# EAGLE design Clamp board - 2S-3.7V rev C- 4 layer v2 (EAGLE 9.3.1)
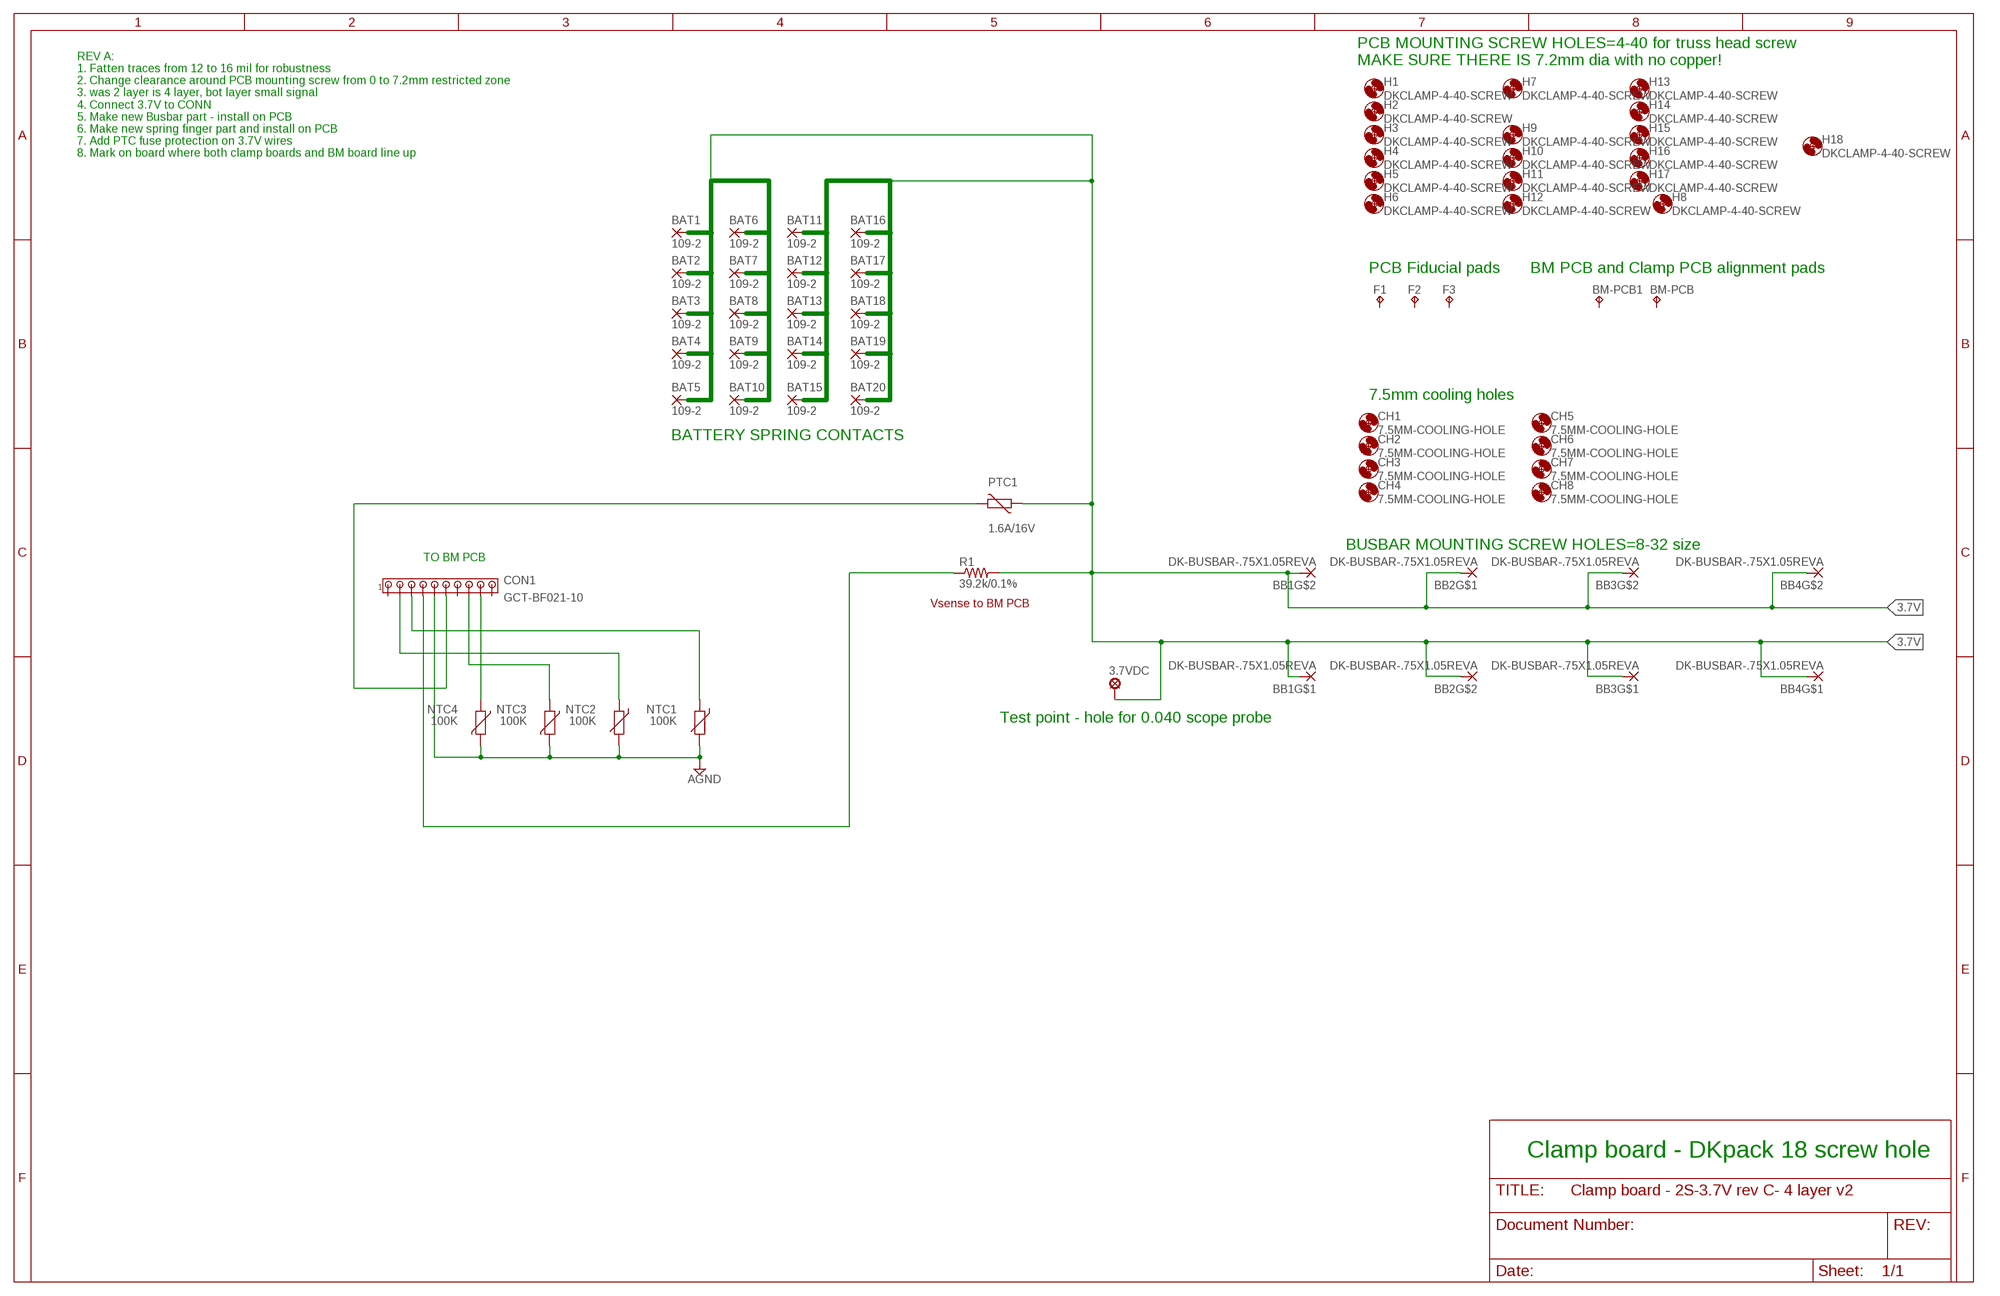
[diagram p0: schematic, sheet 1]

## Parts
3.7VDC  LSP10  [LSP10]
BAT1  109-2  DK-SPRING-REV2  [DK-SPRING-FINGER-REV2]
BAT2  109-2  DK-SPRING-REV2  [DK-SPRING-FINGER-REV2]
BAT3  109-2  DK-SPRING-REV2  [DK-SPRING-FINGER-REV2]
BAT4  109-2  DK-SPRING-REV2  [DK-SPRING-FINGER-REV2]
BAT5  109-2  DK-SPRING-REV2  [DK-SPRING-FINGER-REV2]
BAT6  109-2  DK-SPRING-REV2  [DK-SPRING-FINGER-REV2]
BAT7  109-2  DK-SPRING-REV2  [DK-SPRING-FINGER-REV2]
BAT8  109-2  DK-SPRING-REV2  [DK-SPRING-FINGER-REV2]
BAT9  109-2  DK-SPRING-REV2  [DK-SPRING-FINGER-REV2]
BAT10  109-2  DK-SPRING-REV2  [DK-SPRING-FINGER-REV2]
BAT11  109-2  DK-SPRING-REV2  [DK-SPRING-FINGER-REV2]
BAT12  109-2  DK-SPRING-REV2  [DK-SPRING-FINGER-REV2]
BAT13  109-2  DK-SPRING-REV2  [DK-SPRING-FINGER-REV2]
BAT14  109-2  DK-SPRING-REV2  [DK-SPRING-FINGER-REV2]
BAT15  109-2  DK-SPRING-REV2  [DK-SPRING-FINGER-REV2]
BAT16  109-2  DK-SPRING-REV2  [DK-SPRING-FINGER-REV2]
BAT17  109-2  DK-SPRING-REV2  [DK-SPRING-FINGER-REV2]
BAT18  109-2  DK-SPRING-REV2  [DK-SPRING-FINGER-REV2]
BAT19  109-2  DK-SPRING-REV2  [DK-SPRING-FINGER-REV2]
BAT20  109-2  DK-SPRING-REV2  [DK-SPRING-FINGER-REV2]
BB1  DK-BUSBAR-.75X1.05REVA  [DKBUSBAR]
BB2  DK-BUSBAR-.75X1.05REVA  [DKBUSBAR]
BB3  DK-BUSBAR-.75X1.05REVA  [DKBUSBAR]
BB4  DK-BUSBAR-.75X1.05REVA  [DKBUSBAR]
BM-PCB  FIDUCIALTP15SQ  [TP15SQ]
BM-PCB1  FIDUCIALTP15SQ  [TP15SQ]
CH1  7.5MM-COOLING-HOLE  [7.5MM-COOLING-HOLE]
CH2  7.5MM-COOLING-HOLE  [7.5MM-COOLING-HOLE]
CH3  7.5MM-COOLING-HOLE  [7.5MM-COOLING-HOLE]
CH4  7.5MM-COOLING-HOLE  [7.5MM-COOLING-HOLE]
CH5  7.5MM-COOLING-HOLE  [7.5MM-COOLING-HOLE]
CH6  7.5MM-COOLING-HOLE  [7.5MM-COOLING-HOLE]
CH7  7.5MM-COOLING-HOLE  [7.5MM-COOLING-HOLE]
CH8  7.5MM-COOLING-HOLE  [7.5MM-COOLING-HOLE]
CON1  GCT-BF021-10  [GCT-BF021-10]
F1  FIDUCIALB1,27  [B1,27]
F2  FIDUCIALB1,27  [B1,27]
F3  FIDUCIALB1,27  [B1,27]
H1  DKCLAMP-4-40-SCREW  [2.95MM-HOLE-FOR-4-40SCREW-DKCLAMP]
H2  DKCLAMP-4-40-SCREW  [2.95MM-HOLE-FOR-4-40SCREW-DKCLAMP]
H3  DKCLAMP-4-40-SCREW  [2.95MM-HOLE-FOR-4-40SCREW-DKCLAMP]
H4  DKCLAMP-4-40-SCREW  [2.95MM-HOLE-FOR-4-40SCREW-DKCLAMP]
H5  DKCLAMP-4-40-SCREW  [2.95MM-HOLE-FOR-4-40SCREW-DKCLAMP]
H6  DKCLAMP-4-40-SCREW  [2.95MM-HOLE-FOR-4-40SCREW-DKCLAMP]
H7  DKCLAMP-4-40-SCREW  [2.95MM-HOLE-FOR-4-40SCREW-DKCLAMP]
H8  DKCLAMP-4-40-SCREW  [2.95MM-HOLE-FOR-4-40SCREW-DKCLAMP]
H9  DKCLAMP-4-40-SCREW  [2.95MM-HOLE-FOR-4-40SCREW-DKCLAMP]
H10  DKCLAMP-4-40-SCREW  [2.95MM-HOLE-FOR-4-40SCREW-DKCLAMP]
H11  DKCLAMP-4-40-SCREW  [2.95MM-HOLE-FOR-4-40SCREW-DKCLAMP]
H12  DKCLAMP-4-40-SCREW  [2.95MM-HOLE-FOR-4-40SCREW-DKCLAMP]
H13  DKCLAMP-4-40-SCREW  [2.95MM-HOLE-FOR-4-40SCREW-DKCLAMP]
H14  DKCLAMP-4-40-SCREW  [2.95MM-HOLE-FOR-4-40SCREW-DKCLAMP]
H15  DKCLAMP-4-40-SCREW  [2.95MM-HOLE-FOR-4-40SCREW-DKCLAMP]
H16  DKCLAMP-4-40-SCREW  [2.95MM-HOLE-FOR-4-40SCREW-DKCLAMP]
H17  DKCLAMP-4-40-SCREW  [2.95MM-HOLE-FOR-4-40SCREW-DKCLAMP]
H18  DKCLAMP-4-40-SCREW  [2.95MM-HOLE-FOR-4-40SCREW-DKCLAMP]
NTC1  100K  NTC-MURATA-NCP18WF104J03RB  [0603]
NTC2  100K  NTC-MURATA-NCP18WF104J03RB  [0603]
NTC3  100K  MURATA_VARISTOR  [VARISTOR_0603]
NTC4  100K  MURATA_VARISTOR  [VARISTOR_0603]
PTC1  1.6A/16V  VARISTORCN1812  [CT/CN1812]
R1  39.2k/0.1%  R-US_R0603  [R0603]

## Nets
3.7V: 3.7VDC.MP BAT1.2(P) BAT2.2(P) BAT3.2(P) BAT4.2(P) BAT5.2(P) BAT6.2(P) BAT7.2(P) BAT8.2(P) BAT9.2(P) BAT10.2(P) BAT11.2(P) BAT12.2(P) BAT13.2(P) BAT14.2(P) BAT15.2(P) BAT16.2(P) BAT17.2(P) BAT18.2(P) BAT19.2(P) BAT20.2(P) BB1.P$2 BB1.P$3 BB2.P$2 BB2.P$3 BB3.P$2 BB3.P$3 BB4.P$2 BB4.P$3 PTC1.1 R1.2
3.7VPOWER: CON1.P$6 PTC1.2
3.7VSCALED: CON1.P$4 R1.1
AGND: CON1.P$5 NTC1.2 NTC2.2 NTC3.2 NTC4.2
NTC1: CON1.P$3 NTC1.1
NTC2: CON1.P$2 NTC2.1
NTC3: CON1.P$8 NTC3.1
NTC4: CON1.P$9 NTC4.1
Unconnected: BM-PCB1.TP BM-PCB.TP CON1.P$1 CON1.P$7 CON1.P$10 F1.PP(TP) F2.PP(TP) F3.PP(TP)

## Notes on the sheet
- PCB MOUNTING SCREW HOLES=4-40 for truss head screw 
  MAKE SURE THERE IS 7.2mm dia with no copper!
- REV A: 
  1. Fatten traces from 12 to 16 mil for robustness
  2. Change clearance around PCB mounting screw from 0 to 7.2mm restricted zone
  3. was 2 layer is 4 layer, bot layer small signal
  4. Connect 3.7V to CONN
  5. Make new Busbar part - install on PCB
  6. Make new spring finger part and install on PCB
  7. Add PTC fuse protection on 3.7V wires
  8. Mark on board where both clamp boards and BM board line up
- PCB Fiducial pads | BM PCB and Clamp PCB alignment pads
- 7.5mm cooling holes
- BATTERY SPRING CONTACTS
- BUSBAR MOUNTING SCREW HOLES=8-32 size
- TO BM PCB
- Vsense to BM PCB
- Test point - hole for 0.040 scope probe
- Clamp board - DKpack 18 screw hole

## Library data of the parts
3.7VDC = solpad:LSP10: SOLDER PAD drill 1.0 mm, distributor Buerklin, 12H555
BAT1-BAT20 = Power_board - Copy:DK-SPRING-REV2
BB1-BB4 = Power_board - Copy:DK-BUSBAR-.75X1.05REVA: DK copper busbar for connecting DK blocks, size is .75 in by 1.05 in by 1/8in thick. Takes two 8-32 brass screws into each DK block
BM-PCB BM-PCB1 F1-F3 = offgrid testpad:FIDUCIAL: Fiducial pad - B1,27
CH1-CH8 = offgrid holes:7.5MM-COOLING-HOLE: Cooling hole 7.5mm or .295in hole
CON1 = offgrid con-amp:GCT-BF021-10: GCT BF021-10 also Sullins 40 pos header NRPN401PARN-RC conn header 2mm single RA through hole horizontal
H1-H18 = offgrid holes:DKCLAMP-4-40-SCREW: DKclamp screw hole of 2.95mm and keepout of .130rad or .260 head diameter Use 4-40 screw with truss head for clamp board
NTC1 NTC2 = offgrid varistor:NTC-MURATA-NCP18WF104J03RB: Murata NCP18WF104J03RB 100K NTC 5%
NTC3 NTC4 = DK_Block_Eagle_Library:MURATA_VARISTOR: THERMISTOR 100K OHM NTC Package: 0603 SMD Murata pn NCP18WF104J03RB http://www.digikey.com/product-detail/en/NCP18WF104J03RB/490-2430-1-ND/588644
PTC1 = offgrid varistor:VARISTOR: VARISTOR; MPN: Bel 0ZCG0160BF2C
R1 = offgrid rcl:R-US_: RESISTOR, American symbol

## Board
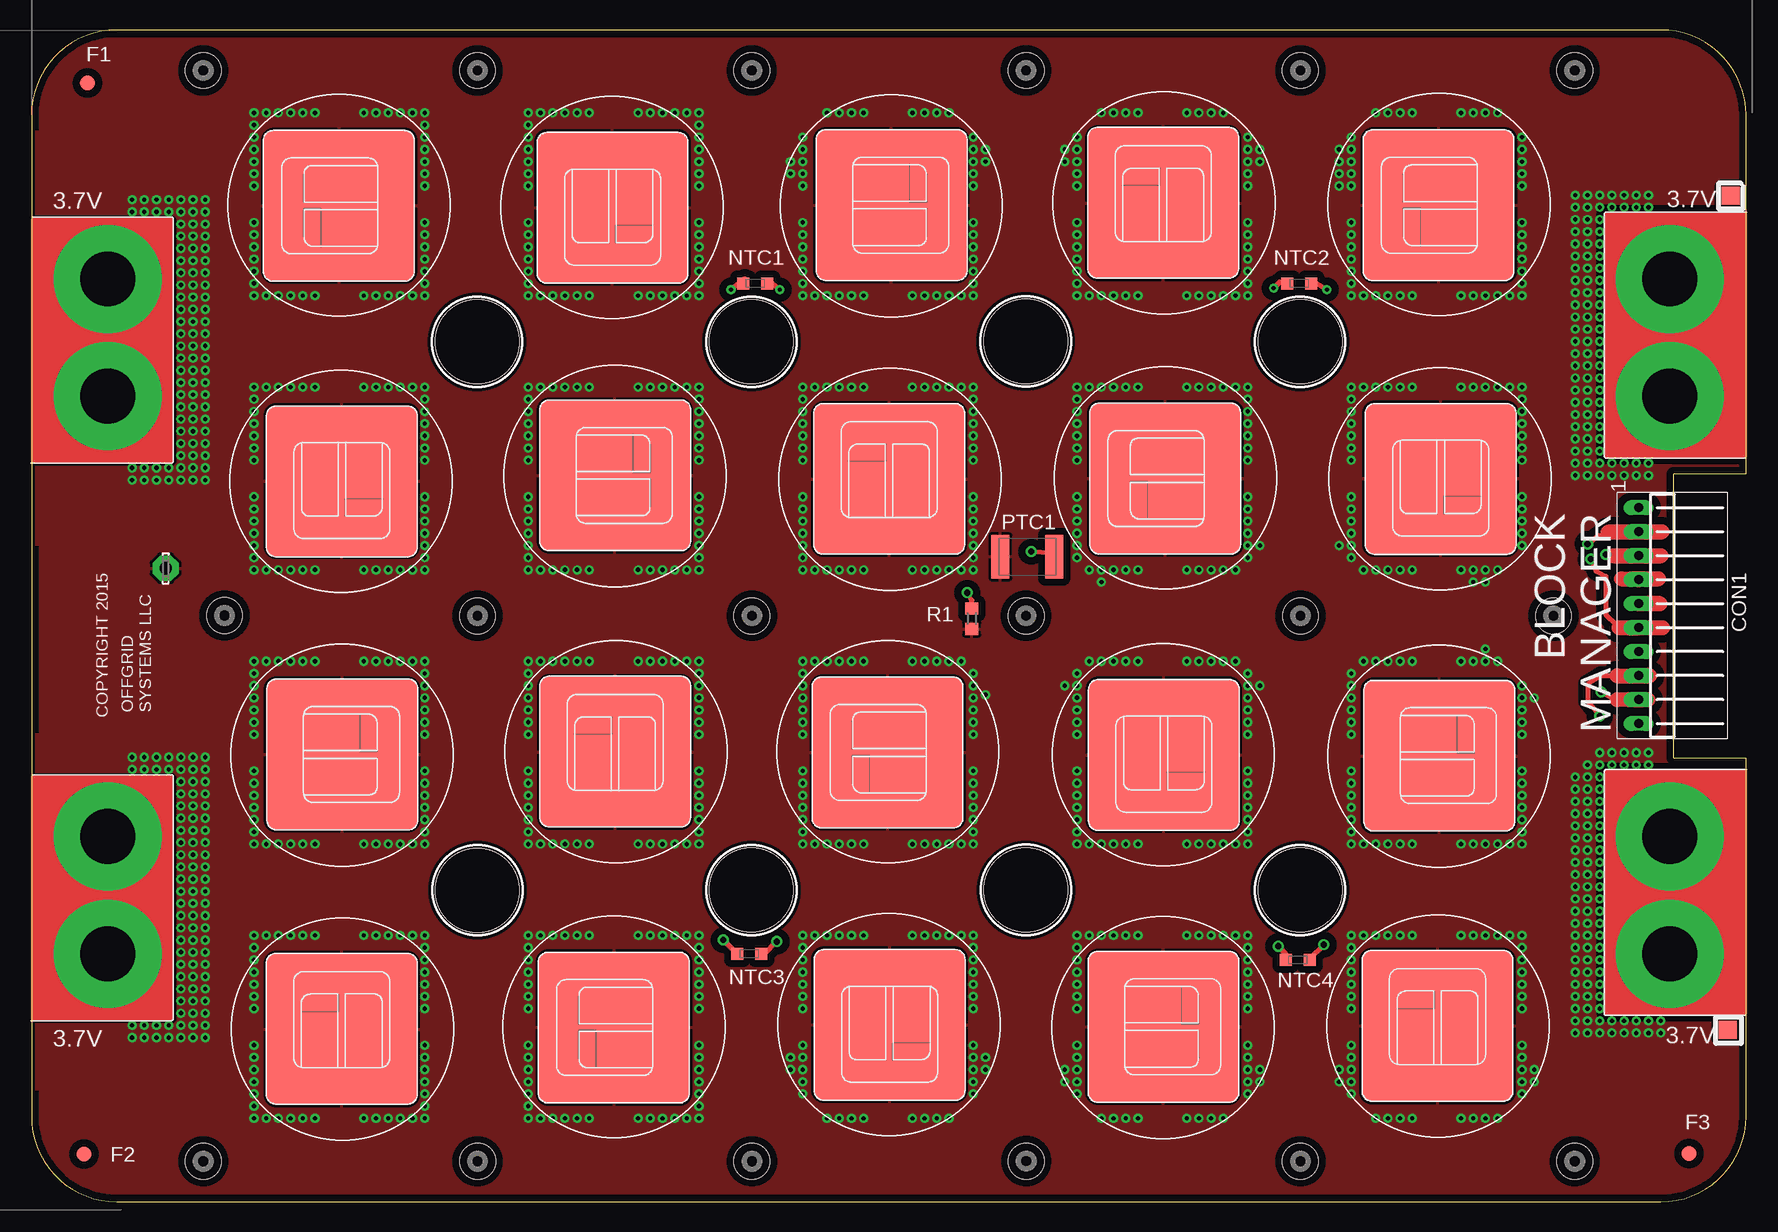
[diagram p1: board, top side]
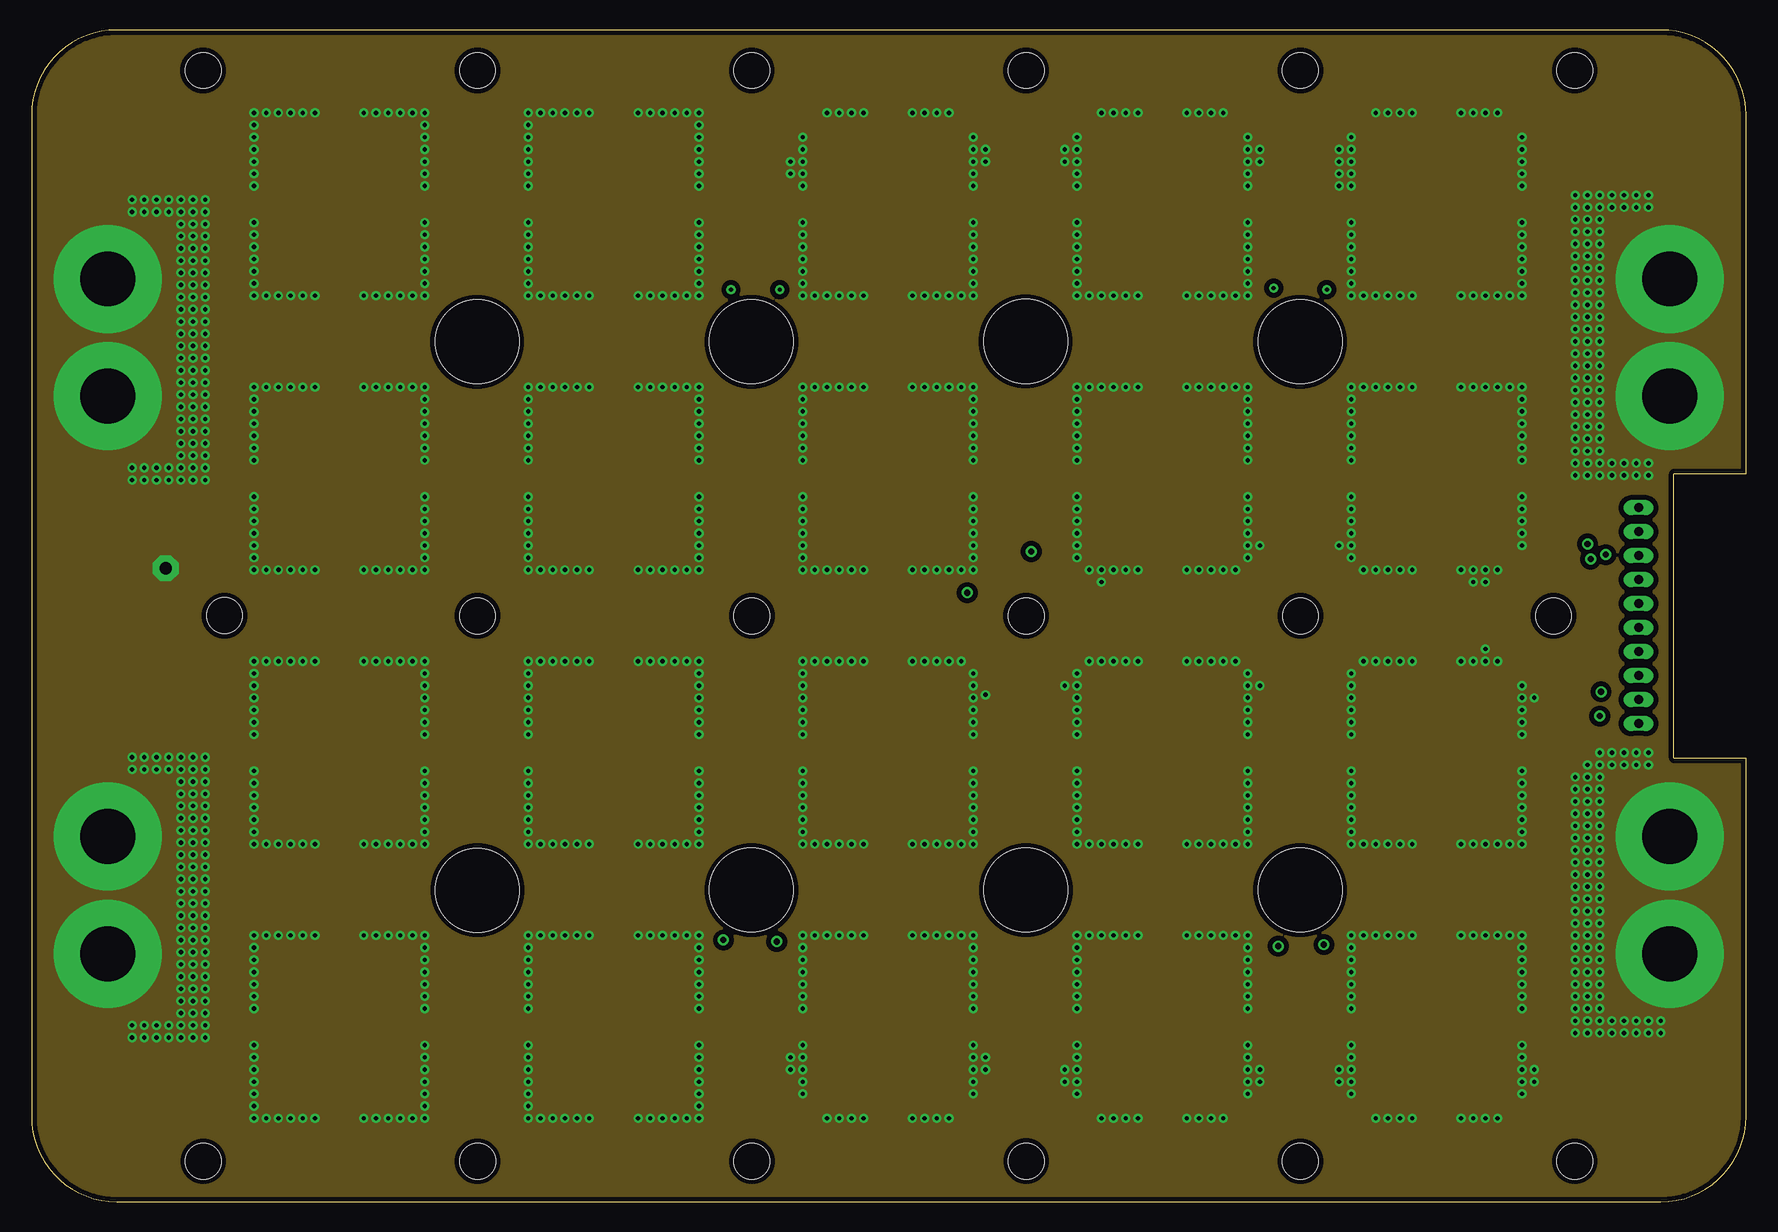
[diagram p2: board, inner layer InsideTop]
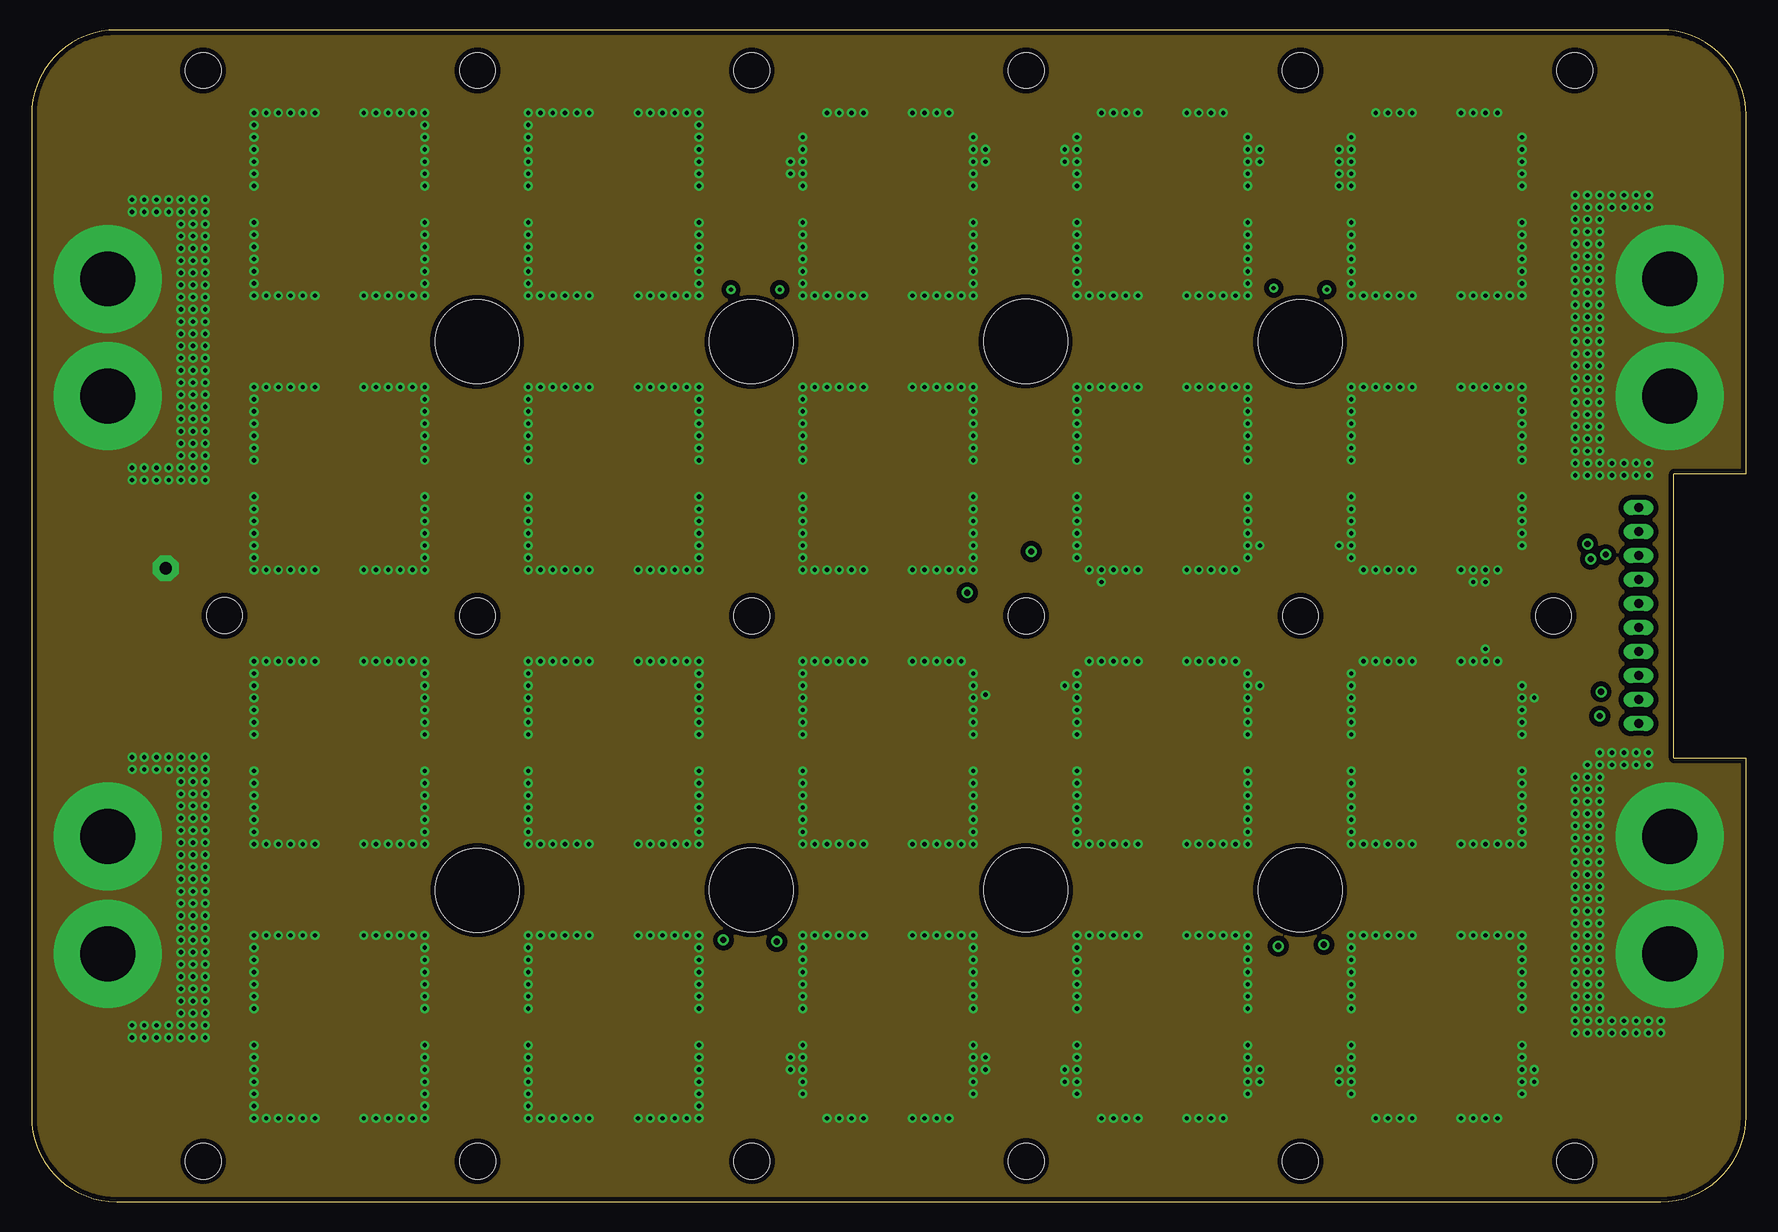
[diagram p3: board, inner layer InsideBot]
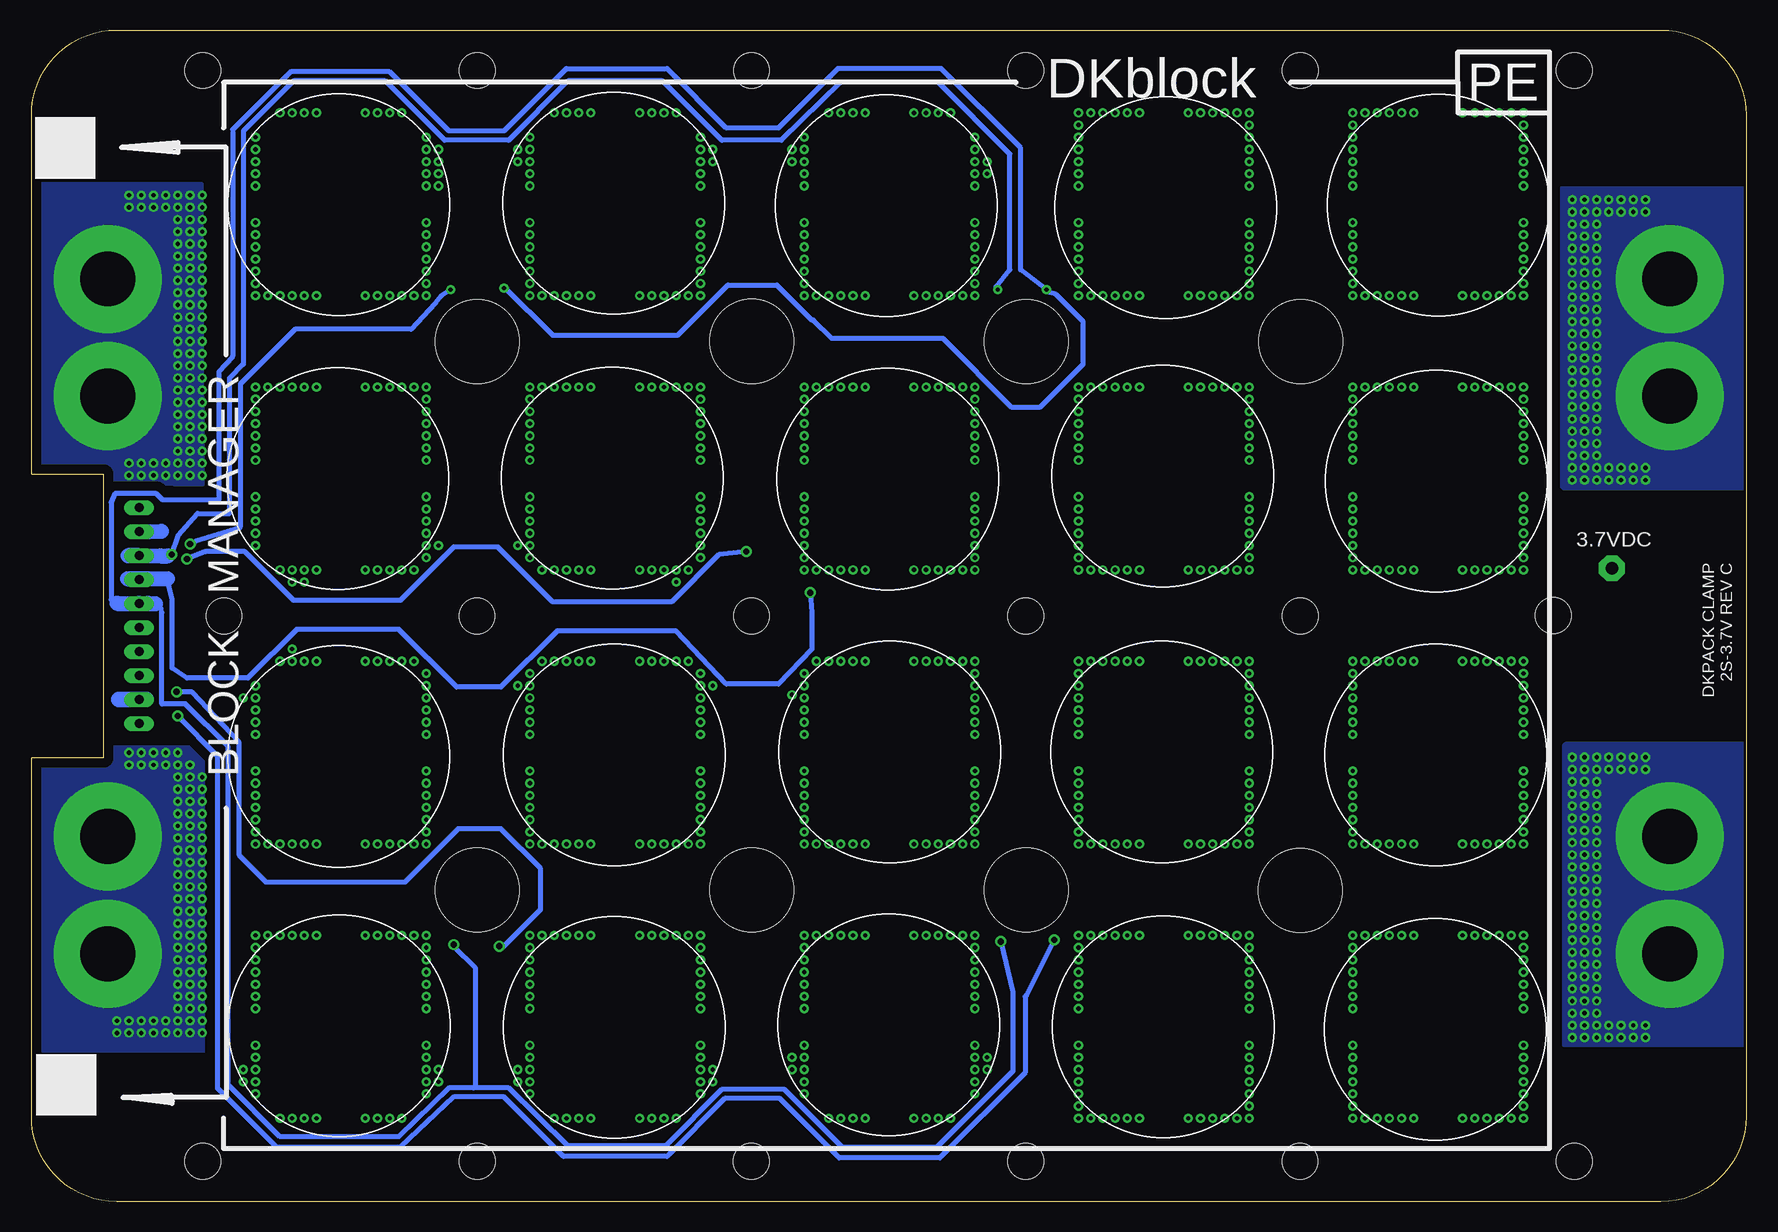
[diagram p4: board, bottom side, seen from below]

Size 142.88 x 97.69 mm. Coordinates in mm from the lower left corner, seen from the top.
Outline: 7.11,0 135.76,0 arc90 142.88,7.11 142.88,36.98 136.87,36.98 136.87,60.68 142.88,60.68 142.88,90.58 arc90 135.76,97.69 7.11,97.69 arc90 0,90.58 0,7.11 arc90 7.11,0
Copper layers ((1*2)+(3*16)): Top 0.035mm / dielectric 1.5mm / InsideTop 0.035mm / dielectric 0.15mm / InsideBot 0.035mm / dielectric 0.2mm / Bottom 0.035mm
Design rules "Offgrid design rules clamp boards 4 layer *": minimum track width 10mil, minimum drill 14mil, track to track 8mil, track to pad 8mil, pad to pad 8mil, via to via 8mil, smd to smd 0mil, copper to edge 10mil, drill to drill 5mil, minimum pad ring 10mil, minimum via ring 8mil, stop-mask expansion 4mil, vias tented up to drill 30mil, thermal gap 10mil

### Footprints (pad centres in the part's own frame; a part is rotated, then mirrored left to right if it is on the bottom)
LSP10 = drill 1.016 pad 2.159 octagon: MP 0,0
DK-SPRING-FINGER-REV2 = smd 12.573 x 12.573: 2 0,0.051
DKBUSBAR = drill 4.572 pad 9: P$2 1.397,-4.889; P$3 1.397,4.889
TP15SQ = smd 1.5 x 1.5: TP 0,0
7.5MM-COOLING-HOLE = hole 6.985: 0,0
GCT-BF021-10 = drill 0.75 long: P$1 9,-0.5; P$2 7,-0.5; P$3 5,-0.5; P$4 3,-0.5; P$5 1,-0.5; P$6 -1,-0.5; P$7 -3,-0.5; P$8 -5,-0.5; P$9 -7,-0.5; P$10 -9,-0.5
B1,27 = smd 1.27 x 1.27: PP 0,0
2.95MM-HOLE-FOR-4-40SCREW-DKCLAMP = hole 2.972: 0,0
0603 = smd 1 x 1: 1 -1,0; 2 1,0
VARISTOR_0603 = smd 1 x 1: 1 -1,0; 2 1,0
CT/CN1812 = smd 1.5 x 3.6: 1 -2.25,0; 2 2.25,0
R0603 = smd 1 x 1.1: 1 -0.85,0; 2 0.85,0

### Placement (x,y rotation side)
3.7VDC  11.17,52.81 90 top
BAT1  117.29,37.13 0 top
BAT2  48.69,37.51 90 top
BAT3  94.31,37.27 270 top
BAT4  117.22,14.65 90 top
BAT5  71.45,14.76 270 top
BAT6  94.3,14.53 0 top
BAT7  48.55,14.58 180 top
BAT8  71.35,37.52 180 top
BAT9  25.91,14.4 90 top
BAT10  25.88,37.23 0 top
BAT11  48.61,60.5 0 top
BAT12  71.65,83.03 0 top
BAT13  25.8,60.08 270 top
BAT14  71.53,60.24 90 top
BAT15  48.36,82.89 270 top
BAT16  117.37,60.28 270 top
BAT17  94.49,60.35 180 top
BAT18  25.63,83.09 180 top
BAT19  117.28,83.14 180 top
BAT20  94.36,83.25 90 top
BB1  4.95,25.57 0 top
BB2  4.95,72.05 0 top
BB3  137.92,72.05 180 top
BB4  137.92,25.57 180 top
BM-PCB  141.35,14.33 90 top
BM-PCB1  141.61,83.87 90 top
CH1  37.12,71.7 0 top
CH2  59.99,71.7 0 top
CH3  82.85,71.73 0 top
CH4  105.71,71.7 0 top
CH5  37.15,25.98 0 top
CH6  59.99,25.99 0 top
CH7  82.86,25.99 0 top
CH8  105.71,25.99 0 top
CON1  133.42,48.87 90 top
F1  4.65,93.27 0 top
F2  4.38,3.97 0 top
F3  138.13,4.04 0 top
H1  14.31,94.31 0 top
H2  37.16,94.31 0 top
H3  60.02,94.31 0 top
H4  82.88,94.31 0 top
H5  105.74,94.31 0 top
H6  128.6,94.31 0 top
H7  37.16,48.84 0 top
H8  16.08,48.87 0 top
H9  60.03,48.84 0 top
H10  82.88,48.84 0 top
H11  105.75,48.84 0 top
H12  14.31,3.38 0 top
H13  37.17,3.38 0 top
H14  60.03,3.38 0 top
H15  82.89,3.39 0 top
H16  105.74,3.38 0 top
H17  128.6,3.38 0 top
H18  126.83,48.84 0 top
NTC1  60.32,76.55 180 top
NTC2  105.66,76.56 180 top
NTC3  59.82,20.68 0 top
NTC4  105.54,20.17 0 top
PTC1  82.98,53.78 0 top
R1  78.36,48.62 270 top

### Tracks (layer width: path | path; a pad name or v marks a point on that pad's centre or on a via)
3.7V  (via drill 0.36)
  other vias: 18.54,87.73 18.54,86.72 18.54,85.7 18.54,84.68 18.54,81.64 18.54,80.62 18.54,79.6 18.54,78.59 18.54,77.57 18.54,76.56 18.54,75.54 19.56,75.54 20.57,75.54 21.59,75.54 22.61,75.54 23.62,75.54 18.54,89.76 18.54,90.78 19.56,90.78 20.57,90.78 21.59,90.78 22.61,90.78 23.62,90.78 27.69,90.78 28.7,90.78 29.72,90.78 30.73,90.78 31.75,90.78 32.77,89.76 32.77,90.78 32.77,88.75 32.77,87.73 32.77,86.72 32.77,85.7 32.77,84.68 32.77,81.64 32.77,80.62 32.77,79.6 32.77,78.59 32.77,77.57 32.77,76.56 32.77,75.54 31.75,75.54 30.73,75.54 29.72,75.54 28.7,75.54 27.69,75.54 18.54,88.75 41.4,87.73 41.4,86.72 41.4,85.7 41.4,84.68 41.4,81.64 41.4,80.62 41.4,79.6 41.4,78.59 41.4,77.57 41.4,76.56 41.4,75.54 42.42,75.54 43.43,75.54 44.45,75.54 45.47,75.54 46.48,75.54 41.4,89.76 41.4,90.78 42.42,90.78 43.43,90.78 44.45,90.78 45.47,90.78 46.48,90.78 50.55,90.78 51.56,90.78 52.58,90.78 53.59,90.78 54.61,90.78 55.63,89.76 55.63,90.78 55.63,88.75 55.63,87.73 55.63,86.72 55.63,85.7 55.63,84.68 55.63,81.64 55.63,80.62 55.63,79.6 55.63,78.59 55.63,77.57 55.63,76.56 55.63,75.54 54.61,75.54 53.59,75.54 52.58,75.54 51.56,75.54 50.55,75.54 41.4,88.75 64.26,87.73 64.26,86.72 64.26,85.7 64.26,84.68 64.26,81.64 64.26,80.62 64.26,79.6 64.26,78.59 64.26,77.57 64.26,76.56 64.26,75.54 65.28,75.54 66.29,75.54 67.31,75.54 68.33,75.54 69.34,75.54 63.25,85.7 63.25,86.72 66.29,90.78 67.31,90.78 68.33,90.78 69.34,90.78 73.41,90.78 74.42,90.78 75.44,90.78 76.45,90.78 79.5,86.72 79.5,87.73 78.49,88.75 78.49,87.73 78.49,86.72 78.49,85.7 78.49,84.68 78.49,81.64 78.49,80.62 78.49,79.6 78.49,78.59 78.49,77.57 78.49,76.56 78.49,75.54 77.47,75.54 76.45,75.54 75.44,75.54 74.42,75.54 73.41,75.54 64.26,88.75 87.12,87.73 87.12,86.72 87.12,85.7 87.12,84.68 87.12,81.64 87.12,80.62 87.12,79.6 87.12,78.59 87.12,77.57 87.12,76.56 87.12,75.54 88.14,75.54 89.15,75.54 90.17,75.54 91.19,75.54 92.2,75.54 86.11,87.73 86.11,86.72 89.15,90.78 90.17,90.78 91.19,90.78 92.2,90.78 96.27,90.78 97.28,90.78 98.3,90.78 99.31,90.78 102.36,87.73 102.36,86.72 101.35,88.75 101.35,87.73 101.35,86.72 101.35,85.7 101.35,84.68 101.35,81.64 101.35,80.62 101.35,79.6 101.35,78.59 101.35,77.57 101.35,76.56 101.35,75.54 100.33,75.54 99.31,75.54 98.3,75.54 97.28,75.54 96.27,75.54 87.12,88.75 109.98,87.73 109.98,86.72 109.98,85.7 109.98,84.68 109.98,81.64 109.98,80.62 109.98,79.6 109.98,78.59 109.98,77.57 109.98,76.56 109.98,75.54 111,75.54 112.01,75.54 113.03,75.54 114.05,75.54 115.06,75.54 108.97,86.72 108.97,87.73 112.01,90.78 113.03,90.78 114.05,90.78 115.06,90.78 119.13,90.78 120.14,90.78 121.16,90.78 122.17,90.78 108.97,85.7 108.97,84.68 124.21,88.75 124.21,87.73 124.21,86.72 124.21,85.7 124.21,84.68 124.21,81.64 124.21,80.62 124.21,79.6 124.21,78.59 124.21,77.57 124.21,76.56 124.21,75.54 123.19,75.54 122.17,75.54 121.16,75.54 120.14,75.54 119.13,75.54 109.98,88.75 109.98,64.87 109.98,63.86 109.98,62.84 109.98,61.82 109.98,58.78 109.98,57.76 109.98,56.74 109.98,55.73 109.98,54.71 109.98,53.7 108.97,54.71 111,52.68 112.01,52.68 113.03,52.68 114.05,52.68 115.06,52.68 109.98,66.9 109.98,67.92 111,67.92 112.01,67.92 113.03,67.92 114.05,67.92 115.06,67.92 119.13,67.92 120.14,67.92 121.16,67.92 122.17,67.92 123.19,67.92 124.21,66.9 124.21,67.92 124.21,65.89 124.21,64.87 124.21,63.86 124.21,62.84 124.21,61.82 124.21,58.78 124.21,57.76 124.21,56.74 124.21,55.73 124.21,54.71 120.14,51.66 121.16,51.66 122.17,52.68 121.16,52.68 120.14,52.68 119.13,52.68 109.98,65.89 87.12,64.87 87.12,63.86 87.12,62.84 87.12,61.82 87.12,58.78 87.12,57.76 87.12,56.74 87.12,55.73 87.12,54.71 87.12,53.7 89.15,51.66 88.14,52.68 89.15,52.68 90.17,52.68 91.19,52.68 92.2,52.68 87.12,66.9 87.12,67.92 88.14,67.92 89.15,67.92 90.17,67.92 91.19,67.92 92.2,67.92 96.27,67.92 97.28,67.92 98.3,67.92 99.31,67.92 100.33,67.92 101.35,66.9 101.35,67.92 101.35,65.89 101.35,64.87 101.35,63.86 101.35,62.84 101.35,61.82 101.35,58.78 101.35,57.76 101.35,56.74 101.35,55.73 101.35,54.71 101.35,53.7 102.36,54.71 100.33,52.68 99.31,52.68 98.3,52.68 97.28,52.68 96.27,52.68 87.12,65.89 64.26,64.87 64.26,63.86 64.26,62.84 64.26,61.82 64.26,58.78 64.26,57.76 64.26,56.74 64.26,55.73 64.26,54.71 64.26,53.7 64.26,52.68 65.28,52.68 66.29,52.68 67.31,52.68 68.33,52.68 69.34,52.68 64.26,66.9 64.26,67.92 65.28,67.92 66.29,67.92 67.31,67.92 68.33,67.92 69.34,67.92 73.41,67.92 74.42,67.92 75.44,67.92 76.45,67.92 77.47,67.92 78.49,66.9 78.49,67.92 78.49,65.89 78.49,64.87 78.49,63.86 78.49,62.84 78.49,61.82 78.49,58.78 78.49,57.76 78.49,56.74 78.49,55.73 78.49,54.71 78.49,53.7 78.49,52.68 77.47,52.68 76.45,52.68 75.44,52.68 74.42,52.68 73.41,52.68 64.26,65.89 41.4,64.87 41.4,63.86 41.4,62.84 41.4,61.82 41.4,58.78 41.4,57.76 41.4,56.74 41.4,55.73 41.4,54.71 41.4,53.7 41.4,52.68 42.42,52.68 43.43,52.68 44.45,52.68 45.47,52.68 46.48,52.68 41.4,66.9 41.4,67.92 42.42,67.92 43.43,67.92 44.45,67.92 45.47,67.92 46.48,67.92 50.55,67.92 51.56,67.92 52.58,67.92 53.59,67.92 54.61,67.92 55.63,66.9 55.63,67.92 55.63,65.89 55.63,64.87 55.63,63.86 55.63,62.84 55.63,61.82 55.63,58.78 55.63,57.76 55.63,56.74 55.63,55.73 55.63,54.71 55.63,53.7 55.63,52.68 54.61,52.68 53.59,52.68 52.58,52.68 51.56,52.68 50.55,52.68 41.4,65.89 18.54,64.87 18.54,63.86 18.54,62.84 18.54,61.82 18.54,58.78 18.54,57.76 18.54,56.74 18.54,55.73 18.54,54.71 18.54,53.7 18.54,52.68 19.56,52.68 20.57,52.68 21.59,52.68 22.61,52.68 23.62,52.68 18.54,66.9 18.54,67.92 19.56,67.92 20.57,67.92 21.59,67.92 22.61,67.92 23.62,67.92 27.69,67.92 28.7,67.92 29.72,67.92 30.73,67.92 31.75,67.92 32.77,66.9 32.77,67.92 32.77,65.89 32.77,64.87 32.77,63.86 32.77,62.84 32.77,61.82 32.77,58.78 32.77,57.76 32.77,56.74 32.77,55.73 32.77,54.71 32.77,53.7 32.77,52.68 31.75,52.68 30.73,52.68 29.72,52.68 28.7,52.68 27.69,52.68 18.54,65.89 18.54,42.01 18.54,41 18.54,39.98 18.54,38.96 18.54,35.92 18.54,34.9 18.54,33.88 18.54,32.87 18.54,31.85 18.54,30.84 18.54,29.82 19.56,29.82 20.57,29.82 21.59,29.82 22.61,29.82 23.62,29.82 18.54,44.04 18.54,45.06 19.56,45.06 20.57,45.06 21.59,45.06 22.61,45.06 23.62,45.06 27.69,45.06 28.7,45.06 29.72,45.06 30.73,45.06 31.75,45.06 32.77,44.04 32.77,45.06 32.77,43.03 32.77,42.01 32.77,41 32.77,39.98 32.77,38.96 32.77,35.92 32.77,34.9 32.77,33.88 32.77,32.87 32.77,31.85 32.77,30.84 32.77,29.82 31.75,29.82 30.73,29.82 29.72,29.82 28.7,29.82 27.69,29.82 18.54,43.03 41.4,42.01 41.4,41 41.4,39.98 41.4,38.96 41.4,35.92 41.4,34.9 41.4,33.88 41.4,32.87 41.4,31.85 41.4,30.84 41.4,29.82 42.42,29.82 43.43,29.82 44.45,29.82 45.47,29.82 46.48,29.82 41.4,44.04 41.4,45.06 42.42,45.06 43.43,45.06 44.45,45.06 45.47,45.06 46.48,45.06 50.55,45.06 51.56,45.06 52.58,45.06 53.59,45.06 54.61,45.06 55.63,44.04 55.63,45.06 55.63,43.03 55.63,42.01 55.63,41 55.63,39.98 55.63,38.96 55.63,35.92 55.63,34.9 55.63,33.88 55.63,32.87 55.63,31.85 55.63,30.84 55.63,29.82 54.61,29.82 53.59,29.82 52.58,29.82 51.56,29.82 50.55,29.82 41.4,43.03 64.26,42.01 64.26,41 64.26,39.98 64.26,38.96 64.26,35.92 64.26,34.9 64.26,33.88 64.26,32.87 64.26,31.85 64.26,30.84 64.26,29.82 65.28,29.82 66.29,29.82 67.31,29.82 68.33,29.82 69.34,29.82 64.26,44.04 64.26,45.06 65.28,45.06 66.29,45.06 67.31,45.06 68.33,45.06 69.34,45.06 73.41,45.06 74.42,45.06 75.44,45.06 76.45,45.06 77.47,45.06 78.49,44.04 79.5,42.27 78.49,43.03 78.49,42.01 78.49,41 78.49,39.98 78.49,38.96 78.49,35.92 78.49,34.9 78.49,33.88 78.49,32.87 78.49,31.85 78.49,30.84 78.49,29.82 77.47,29.82 76.45,29.82 75.44,29.82 74.42,29.82 73.41,29.82 64.26,43.03 87.12,42.01 87.12,41 87.12,39.98 87.12,38.96 87.12,35.92 87.12,34.9 87.12,33.88 87.12,32.87 87.12,31.85 87.12,30.84 87.12,29.82 88.14,29.82 89.15,29.82 90.17,29.82 91.19,29.82 92.2,29.82 87.12,44.04 86.11,43.03 88.14,45.06 89.15,45.06 90.17,45.06 91.19,45.06 92.2,45.06 96.27,45.06 97.28,45.06 98.3,45.06 99.31,45.06 100.33,45.06 101.35,44.04 102.36,43.03 101.35,43.03 101.35,42.01 101.35,41 101.35,39.98 101.35,38.96 101.35,35.92 101.35,34.9 101.35,33.88 101.35,32.87 101.35,31.85 101.35,30.84 101.35,29.82 100.33,29.82 99.31,29.82 98.3,29.82 97.28,29.82 96.27,29.82 87.12,43.03 109.98,42.01 109.98,41 109.98,39.98 109.98,38.96 109.98,35.92 109.98,34.9 109.98,33.88 109.98,32.87 109.98,31.85 109.98,30.84 109.98,29.82 111,29.82 112.01,29.82 113.03,29.82 114.05,29.82 115.06,29.82 109.98,44.04 111,45.06 112.01,45.06 113.03,45.06 114.05,45.06 115.06,45.06 119.13,45.06 120.14,45.06 121.16,45.06 122.17,45.06 121.16,46.08 125.22,42.01 124.21,43.03 124.21,42.01 124.21,41 124.21,39.98 124.21,38.96 124.21,35.92 124.21,34.9 124.21,33.88 124.21,32.87 124.21,31.85 124.21,30.84 124.21,29.82 123.19,29.82 122.17,29.82 121.16,29.82 120.14,29.82 119.13,29.82 109.98,43.03 109.98,19.15 109.98,18.14 109.98,17.12 109.98,16.1 109.98,13.06 109.98,12.04 109.98,11.02 109.98,10.01 109.98,8.99 108.97,11.02 108.97,10.01 112.01,6.96 113.03,6.96 114.05,6.96 115.06,6.96 109.98,21.18 109.98,22.2 111,22.2 112.01,22.2 113.03,22.2 114.05,22.2 115.06,22.2 119.13,22.2 120.14,22.2 121.16,22.2 122.17,22.2 123.19,22.2 124.21,21.18 124.21,22.2 124.21,20.17 124.21,19.15 124.21,18.14 124.21,17.12 124.21,16.1 124.21,13.06 124.21,12.04 124.21,11.02 124.21,10.01 124.21,8.99 125.22,11.02 125.22,10.01 122.17,6.96 121.16,6.96 120.14,6.96 119.13,6.96 109.98,20.17 87.12,19.15 87.12,18.14 87.12,17.12 87.12,16.1 87.12,13.06 87.12,12.04 87.12,11.02 87.12,10.01 87.12,8.99 86.11,10.01 86.11,11.02 89.15,6.96 90.17,6.96 91.19,6.96 92.2,6.96 87.12,21.18 87.12,22.2 88.14,22.2 89.15,22.2 90.17,22.2 91.19,22.2 92.2,22.2 96.27,22.2 97.28,22.2 98.3,22.2 99.31,22.2 100.33,22.2 101.35,21.18 101.35,22.2 101.35,20.17 101.35,19.15 101.35,18.14 101.35,17.12 101.35,16.1 101.35,13.06 101.35,12.04 101.35,11.02 101.35,10.01 101.35,8.99 102.36,11.02 102.36,10.01 99.31,6.96 98.3,6.96 97.28,6.96 96.27,6.96 87.12,20.17 64.26,19.15 64.26,18.14 64.26,17.12 64.26,16.1 64.26,13.06 64.26,12.04 64.26,11.02 64.26,10.01 64.26,8.99 63.25,11.02 63.25,12.04 66.29,6.96 67.31,6.96 68.33,6.96 69.34,6.96 64.26,21.18 64.26,22.2 65.28,22.2 66.29,22.2 67.31,22.2 68.33,22.2 69.34,22.2 73.41,22.2 74.42,22.2 75.44,22.2 76.45,22.2 77.47,22.2 78.49,21.18 78.49,22.2 78.49,20.17 78.49,19.15 78.49,18.14 78.49,17.12 78.49,16.1 78.49,13.06 78.49,12.04 78.49,11.02 78.49,10.01 78.49,8.99 79.5,12.04 79.5,11.02 76.45,6.96 75.44,6.96 74.42,6.96 73.41,6.96 64.26,20.17 41.4,19.15 41.4,18.14 41.4,17.12 41.4,16.1 41.4,13.06 41.4,12.04 41.4,11.02 41.4,10.01 41.4,8.99 41.4,7.98 41.4,6.96 42.42,6.96 43.43,6.96 44.45,6.96 45.47,6.96 46.48,6.96 41.4,21.18 41.4,22.2 42.42,22.2 43.43,22.2 44.45,22.2 45.47,22.2 46.48,22.2 50.55,22.2 51.56,22.2 52.58,22.2 53.59,22.2 54.61,22.2 55.63,21.18 55.63,22.2 55.63,20.17 55.63,19.15 55.63,18.14 55.63,17.12 55.63,16.1 55.63,13.06 55.63,12.04 55.63,11.02 55.63,10.01 55.63,8.99 55.63,7.98 55.63,6.96 54.61,6.96 53.59,6.96 52.58,6.96 51.56,6.96 50.55,6.96 41.4,20.17 18.54,19.15 18.54,18.14 18.54,17.12 18.54,16.1 18.54,13.06 18.54,12.04 18.54,11.02 18.54,10.01 18.54,8.99 18.54,7.98 18.54,6.96 19.56,6.96 20.57,6.96 21.59,6.96 22.61,6.96 23.62,6.96 18.54,21.18 18.54,22.2 19.56,22.2 20.57,22.2 21.59,22.2 22.61,22.2 23.62,22.2 27.69,22.2 28.7,22.2 29.72,22.2 30.73,22.2 31.75,22.2 32.77,21.18 32.77,22.2 32.77,20.17 32.77,19.15 32.77,18.14 32.77,17.12 32.77,16.1 32.77,13.06 32.77,12.04 32.77,11.02 32.77,10.01 32.77,8.99 32.77,7.98 32.77,6.96 31.75,6.96 30.73,6.96 29.72,6.96 28.7,6.96 27.69,6.96 18.54,20.17 128.65,83.92 128.65,82.91 128.65,81.89 128.65,80.87 128.65,79.86 128.65,78.84 128.65,77.83 128.65,76.81 128.65,75.79 128.65,74.78 128.65,73.76 128.65,72.75 128.65,70.71 128.65,71.73 128.65,69.7 128.65,68.68 128.65,67.67 128.65,66.65 128.65,65.63 128.65,64.62 128.65,63.6 128.65,62.59 128.65,61.57 128.65,60.55 129.67,60.55 129.67,61.57 129.67,62.59 129.67,63.6 129.67,64.62 129.67,65.63 129.67,66.65 129.67,67.67 129.67,68.68 129.67,69.7 129.67,70.71 129.67,71.73 129.67,72.75 129.67,73.76 129.67,74.78 129.67,75.79 129.67,76.81 129.67,77.83 129.67,78.84 129.67,79.86 129.67,80.87 129.67,81.89 129.67,82.91 129.67,83.92 130.68,83.92 131.7,83.92 131.7,82.91 130.68,82.91 130.68,81.89 130.68,80.87 130.68,79.86 130.68,78.84 130.68,77.83 130.68,76.81 130.68,75.79 130.68,74.78 130.68,73.76 130.68,72.75 130.68,71.73 130.68,70.71 130.68,69.7 130.68,68.68 130.68,67.67 130.68,66.65 130.68,65.63 130.68,64.62 130.68,63.6 130.68,62.59 130.68,61.57 130.68,60.55 131.7,61.57 131.7,60.55 132.72,61.57 133.73,61.57 134.75,61.57 134.75,82.91 133.73,82.91 132.72,82.91 132.72,83.92 133.73,83.92 134.75,83.92 132.72,60.55 133.73,60.55 134.75,60.55 14.48,60.17 14.48,61.19 14.48,62.2 14.48,63.22 14.48,64.24 14.48,65.25 14.48,66.27 14.48,67.28 14.48,68.3 14.48,69.32 14.48,70.33 14.48,71.35 14.48,73.38 14.48,72.36 14.48,74.4 14.48,75.41 14.48,76.43 14.48,77.44 14.48,78.46 14.48,79.48 14.48,80.49 14.48,81.51 14.48,82.52 14.48,83.54 13.46,83.54 13.46,82.52 13.46,81.51 13.46,80.49 13.46,79.48 13.46,78.46 13.46,77.44 13.46,76.43 13.46,75.41 13.46,74.4 13.46,73.38 13.46,72.36 13.46,71.35 13.46,70.33 13.46,69.32 13.46,68.3 13.46,67.28 13.46,66.27 13.46,65.25 13.46,64.24 13.46,63.22 13.46,62.2 13.46,61.19 13.46,60.17 12.45,60.17 11.43,60.17 11.43,61.19 12.45,61.19 12.45,62.2 12.45,63.22 12.45,64.24 12.45,65.25 12.45,66.27 12.45,67.28 12.45,68.3 12.45,69.32 12.45,70.33 12.45,71.35 12.45,72.36 12.45,73.38 12.45,74.4 12.45,75.41 12.45,76.43 12.45,77.44 12.45,78.46 12.45,79.48 12.45,80.49 12.45,81.51 12.45,82.52 12.45,83.54 11.43,82.52 11.43,83.54 10.41,82.52 9.4,82.52 8.38,82.52 8.38,61.19 9.4,61.19 10.41,61.19 10.41,60.17 9.4,60.17 8.38,60.17 10.41,83.54 9.4,83.54 8.38,83.54 14.48,13.69 14.48,14.71 14.48,15.72 14.48,16.74 14.48,17.75 14.48,18.77 14.48,19.79 14.48,20.8 14.48,21.82 14.48,22.83 14.48,23.85 14.48,24.87 14.48,26.9 14.48,25.88 14.48,27.91 14.48,28.93 14.48,29.95 14.48,30.96 14.48,31.98 14.48,32.99 14.48,34.01 14.48,35.03 14.48,36.04 14.48,37.06 13.46,37.06 13.46,36.04 13.46,35.03 13.46,34.01 13.46,32.99 13.46,31.98 13.46,30.96 13.46,29.95 13.46,28.93 13.46,27.91 13.46,26.9 13.46,25.88 13.46,24.87 13.46,23.85 13.46,22.83 13.46,21.82 13.46,20.8 13.46,19.79 13.46,18.77 13.46,17.75 13.46,16.74 13.46,15.72 13.46,14.71 13.46,13.69 12.45,13.69 11.43,13.69 11.43,14.71 12.45,14.71 12.45,15.72 12.45,16.74 12.45,17.75 12.45,18.77 12.45,19.79 12.45,20.8 12.45,21.82 12.45,22.83 12.45,23.85 12.45,24.87 12.45,25.88 12.45,26.9 12.45,27.91 12.45,28.93 12.45,29.95 12.45,30.96 12.45,31.98 12.45,32.99 12.45,34.01 12.45,35.03 12.45,36.04 12.45,37.06 11.43,36.04 11.43,37.06 10.41,36.04 9.4,36.04 8.38,36.04 8.38,14.71 9.4,14.71 10.41,14.71 10.41,13.69 9.4,13.69 8.38,13.69 10.41,37.06 9.4,37.06 8.38,37.06 135.76,14.07 128.65,35.41 128.65,34.39 128.65,33.38 128.65,32.36 128.65,31.34 128.65,30.33 128.65,29.31 128.65,28.3 128.65,27.28 128.65,26.26 128.65,24.23 128.65,25.25 128.65,23.22 128.65,22.2 128.65,21.18 128.65,20.17 128.65,19.15 128.65,18.14 128.65,17.12 128.65,16.1 128.65,15.09 128.65,14.07 129.67,14.07 129.67,15.09 129.67,16.1 129.67,17.12 129.67,18.14 129.67,19.15 129.67,20.17 129.67,21.18 129.67,22.2 129.67,23.22 129.67,24.23 129.67,25.25 129.67,26.26 129.67,27.28 129.67,28.3 129.67,29.31 129.67,30.33 129.67,31.34 129.67,32.36 129.67,33.38 129.67,34.39 129.67,35.41 129.67,36.42 135.76,15.09 130.68,37.44 131.7,37.44 131.7,36.42 130.68,36.42 130.68,35.41 130.68,34.39 130.68,33.38 130.68,32.36 130.68,31.34 130.68,30.33 130.68,29.31 130.68,28.3 130.68,27.28 130.68,26.26 130.68,25.25 130.68,24.23 130.68,23.22 130.68,22.2 130.68,21.18 130.68,20.17 130.68,19.15 130.68,18.14 130.68,17.12 130.68,16.1 130.68,15.09 130.68,14.07 131.7,15.09 131.7,14.07 132.72,15.09 133.73,15.09 134.75,15.09 134.75,36.42 133.73,36.42 132.72,36.42 132.72,37.44 133.73,37.44 134.75,37.44 132.72,14.07 133.73,14.07 134.75,14.07
  pour Top (isolate 0.61): -1.27,97.51 143.38,97.64 143.38,-0.66 -1.4,-0.66 -1.4,95.86
  pour Bottom (isolate 0.813, no thermals): 128.68,84.89 143.43,84.89 143.43,60.02 128.63,59.77 128.63,61.24
  pour Top (no thermals): 0.15,38.91 15.77,38.91 15.77,9.4 -0.13,9.4 0.38,17.83
  pour Top (no thermals): -2.34,89.13 15.77,89.43 15.77,54.84 -2.11,54.84
  pour InsideTop (isolate 0.406, no thermals): -2.94,100.1 148.06,100.1 148.06,-2.1 -3.34,-2.1 -3.34,95.5
  pour Top (isolate 0.61, no thermals): 129.67,14.07 129.67,36.93 144.4,36.93 144.4,14.07
  pour Top (isolate 0.61, no thermals): 130.18,83.16 144.91,83.16 144.91,61.32 129.67,61.32 129.67,82.14
  pour InsideBot (isolate 0.406, no thermals): -4.94,101.3 149.86,101.3 149.86,-2.5 -5.14,-2.5 -5.14,97.5
  pour Bottom (isolate 0.254, no thermals): -0.76,38.2 14.99,38.2 arc-90 15.24,37.95 15.24,13.06 -0.64,13.06 arc-90 -0.89,13.31
  pour Bottom (isolate 0.254, no thermals): -1.27,84.56 -1.27,60.17 -1.27,59.41 15.11,59.41 arc90 15.37,59.66 15.37,82.4 15.37,84.05 15.37,84.56 -0.64,84.56
  pour Bottom (isolate 0.813, no thermals): 144.4,37.95 127.38,37.95 arc90 127.13,37.69 127.13,12.55 144.15,12.55 arc90 144.4,12.8 144.4,27.79
3.7VPOWER  (via drill 0.51)
  Top 0.406: PTC1.2 84.98,54.06 v83.31,54.2 | v129.92,53.57 130.38,52.58 131.2,52.14 131.2,48.94 132.08,48.11 132.86,48.11 132.31,47.85
  Top 1.27: 135.93,47.85 133.9,47.85 | 132.31,47.85 133.11,47.85 133.9,47.85 | 133.9,47.85 CON1.P$6
  Bottom 0.406: v83.31,54.2 85.6,53.95 89.53,50.01 99.44,50.01 104.01,54.58 107.7,54.58 112.14,50.14 121.03,50.14 125.09,54.2 128.4,54.2 v129.92,53.57
3.7VSCALED  (via drill 0.51)
  Top 0.406: R1.1 78.36,50.14 v77.98,50.77
  Top 1.27: CON1.P$4 132.48,51.92 135.58,51.92 133.33,51.92
  Bottom 0.406: v77.98,50.77 77.85,49.12 77.85,46.08 80.65,43.15 84.96,43.15 89.15,47.6 99.06,47.6 103.76,42.9 107.44,42.9 112.27,47.73 120.78,47.73 124.84,43.66 129.92,43.66 131.15,44.49 131.15,50.21 131.56,51.92
  Bottom 1.27: 131.56,51.92 134.86,51.92 CON1.P$4
AGND  (via drill 0.36, 0.51)
  Top 0.406: NTC1.2 59.45,76.95 v58.29,76.05 | NTC3.2 61.09,20.68 v62.1,21.69 | NTC4.2 106.54,20.28 v107.7,21.44 | NTC2.2 104.01,76.68 v103.5,76.17
  Top 1.27: CON1.P$5 135.71,49.87 134.72,49.89
  Bottom 0.254: 136.23,50.19 136.08,50.19 135.77,49.89
  Bottom 0.406: v62.1,21.69 61.09,17.5 61.09,10.9 67.44,4.55 75.31,4.55 80.14,9.37 85.34,9.37 90.04,4.67 98.17,4.67 103.12,9.5 106.05,9.5 | 106.05,9.5 108.08,9.5 112.27,5.44 122.17,5.44 126.49,9.75 126.49,37.95 130.05,41.5 131.86,41.5 132.01,41.5 132.01,49.1 132.06,49.48 132.97,49.89 | v107.7,21.44 107.7,21.31 105.92,19.53 105.92,9.63 106.05,9.5 | v103.5,76.17 103.5,76.3 99.44,72.24 89.03,72.24 84.84,76.43 80.77,76.43 77.85,73.51 77.72,73.51 76.2,71.98 66.93,71.98 61.21,66.27 58.8,66.27 55.24,69.82 55.24,73.38 57.53,75.67 58.04,75.79 v58.29,76.05 60.45,77.7 60.45,87.86 67.06,94.46 75.69,94.46 80.65,89.51 84.96,89.51 89.92,94.46 98.3,94.46 103.5,89.26 108.08,89.26 113.03,94.21 121.28,94.21 126.11,89.38 126.11,70.46 127.25,69.19 127.25,58.52 131.95,58.52 132.46,59.03 135.93,59.03 136.23,58.32 136.23,50.19
  Bottom 0.61: 133.17,49.89 132.97,49.89
  Bottom 1.27: 133.17,49.89 133.19,49.87 CON1.P$5 133.91,49.89 135.77,49.89 132.56,49.87
NTC1  (via drill 0.36, 0.51)
  Top 0.406: NTC1.1 61.45,76.83 v62.36,76.05 | 134.89,53.85 134.85,53.85 131.22,53.85 v131.19,53.95
  Top 1.27: CON1.P$3 134.83,53.87 134.85,53.85 | 131.84,53.85 135.57,53.85 135.78,53.85 134.89,53.85 133.12,53.85 131.84,53.85
  Bottom 0.406: v62.36,76.05 62.48,76.05 62.48,76.3 61.34,77.7 61.34,87.35 67.31,93.32 75.44,93.32 80.39,88.49 85.34,88.49 90.3,93.45 98.17,93.45 103.12,88.49 108.46,88.49 113.41,93.45 121.03,93.45 125.22,89.26 125.22,69.82 126.37,68.68 126.37,57.38 129.03,57.38 130.66,55.55 v131.19,53.95
  Bottom 1.27: CON1.P$3 134.84,53.87 134.21,53.9 132.11,53.85 131.5,53.85
NTC2  (via drill 0.36, 0.51)
  Top 0.406: v129.67,54.84 130.56,55.55 134.58,55.55 134.84,55.8 | NTC2.1 106.93,76.68 v107.95,76.05
  Top 1.27: 131.39,55.83 134.44,55.88 135.86,55.85 134.84,55.8 131.39,55.83 | 131.39,55.83 133.14,55.83 133.17,55.87 CON1.P$2
  Bottom 0.406: v107.95,76.05 108.71,75.54 109.22,74.9 111.25,72.75 120.9,72.75 125.48,68.17 125.48,56.34 arc45 125.55,56.16 129.16,55.09 v129.67,54.84
  Bottom 1.27: CON1.P$2 133.12,55.87 132.06,55.9
NTC3  (via drill 0.51)
  Top 0.406: NTC3.1 58.8,20.68 v57.66,21.82 | 132.11,43.85 130.75,43.85 129.7,43.15 129.7,41.76 v130.68,40.49
  Top 1.27: 132.11,43.85 134.82,43.85 134.82,43.87 CON1.P$8
  Bottom 0.406: v57.66,21.82 59.94,17.25 60.07,17.12 60.07,10.77 67.18,3.66 75.56,3.66 80.52,8.61 85.09,8.61 89.92,3.78 98.55,3.78 103.5,8.74 107.7,8.74 112.14,4.55 122.43,4.55 127.38,9.5 127.38,37.19 v130.68,40.49
NTC4  (via drill 0.51)
  Top 0.406: NTC4.1 104.54,20.66 v103.89,21.31 | v130.79,42.52 131.7,42.01 131.95,42.01 132.11,41.85
  Top 1.27: 132.11,41.85 133.11,41.86 134.72,41.86 134.72,41.87 CON1.P$9 133.91,41.88
  Bottom 0.406: v103.89,21.31 103.5,21.31 100.46,24.36 100.46,27.79 103.76,31.09 107.31,31.09 111.76,26.64 123.32,26.64 125.6,28.93 125.6,38.33 129.54,42.52 v130.79,42.52
  Bottom 1.27: CON1.P$9 135.61,41.87 135.61,41.88 133.91,41.88 | 133.91,41.88 133.27,41.88 133.27,41.86 CON1.P$9 133.91,41.88

### Text on the board
tPlace: 3.7V | 3.7V | 3.7V | 3.7V
bPlace: DKblock | PE
tNames: BLOCK / MANAGER | COPYRIGHT 2015 | OFFGRID / SYSTEMS LLC
bNames: BLOCK MANAGER | DKPACK CLAMP / 2S-3.7V REV C
TimsDesignNotes: NCR18650B Rdc = 54 mohms | Use pour thermal as fuse = 20A per cell | so 6mil wide trace will fuse at 1000C at 5A | and 5A x 4 ea = 20A fuse | so set pour poly thickness for cell spring contact at 0.003 | polygon = use 0.003" wide trace | use 25 thou spacing (0.6mm) around all 36VDC per IPC2221 | ( this spacing requires no conformal coating)